# EAGLE schematic ELE3000.5 (EAGLE 6.1)
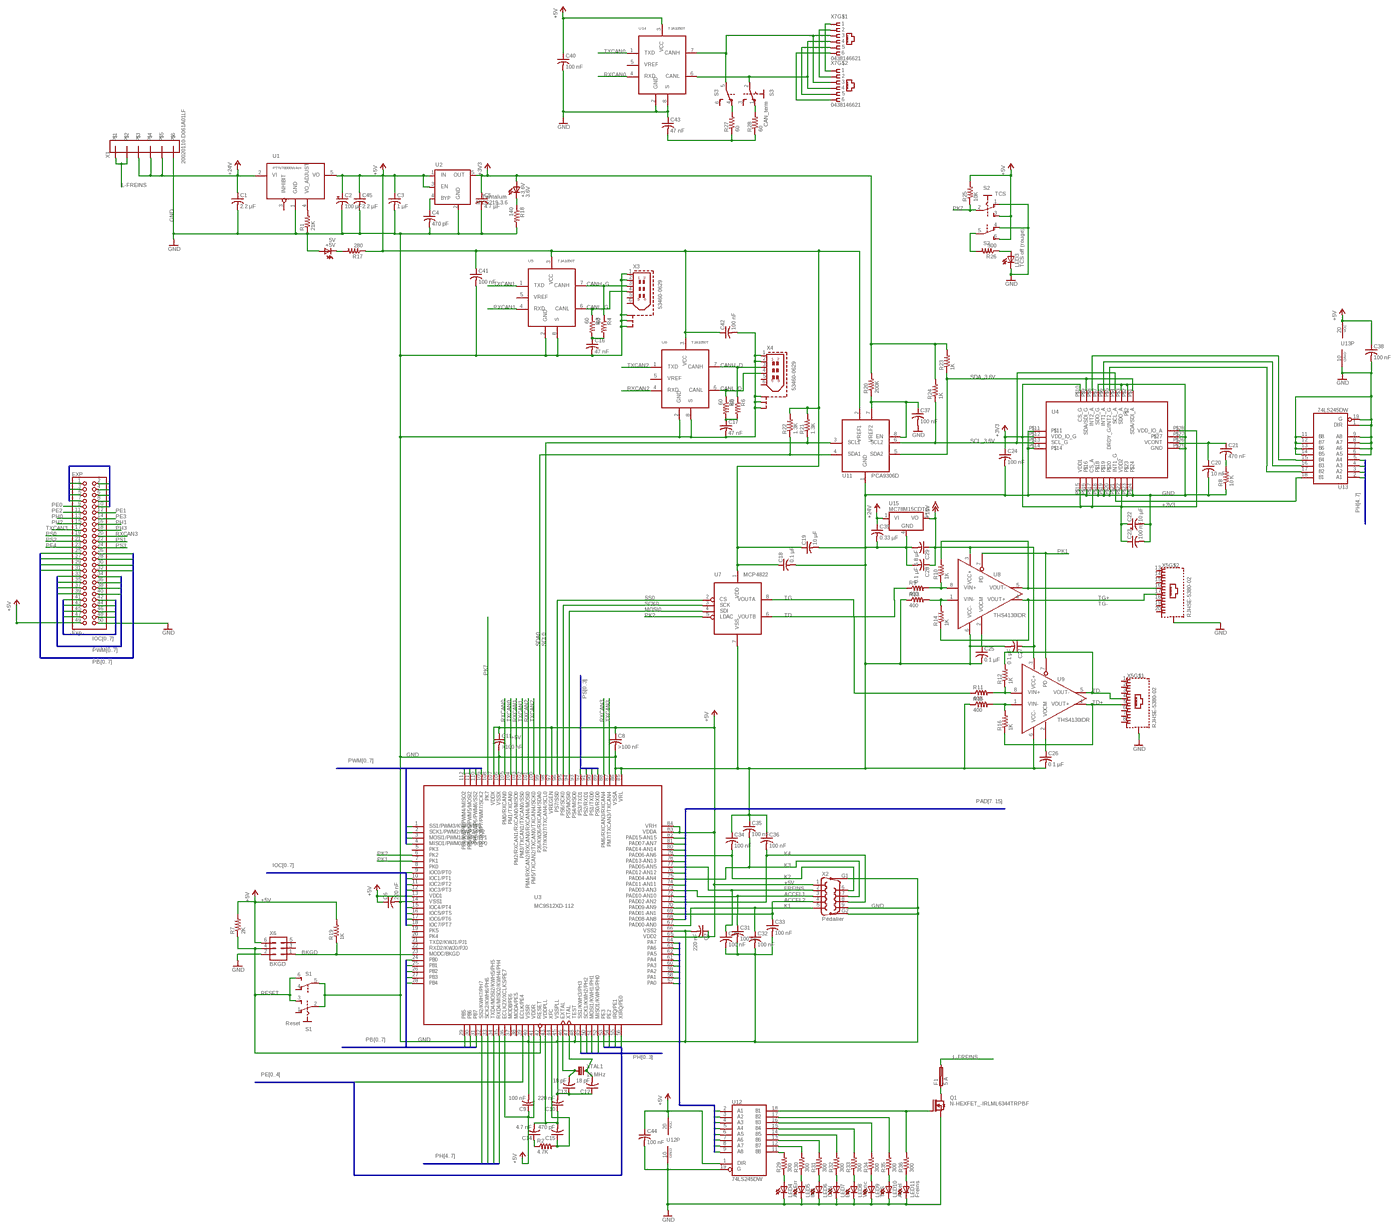
[diagram p0: schematic, sheet 1, overview]
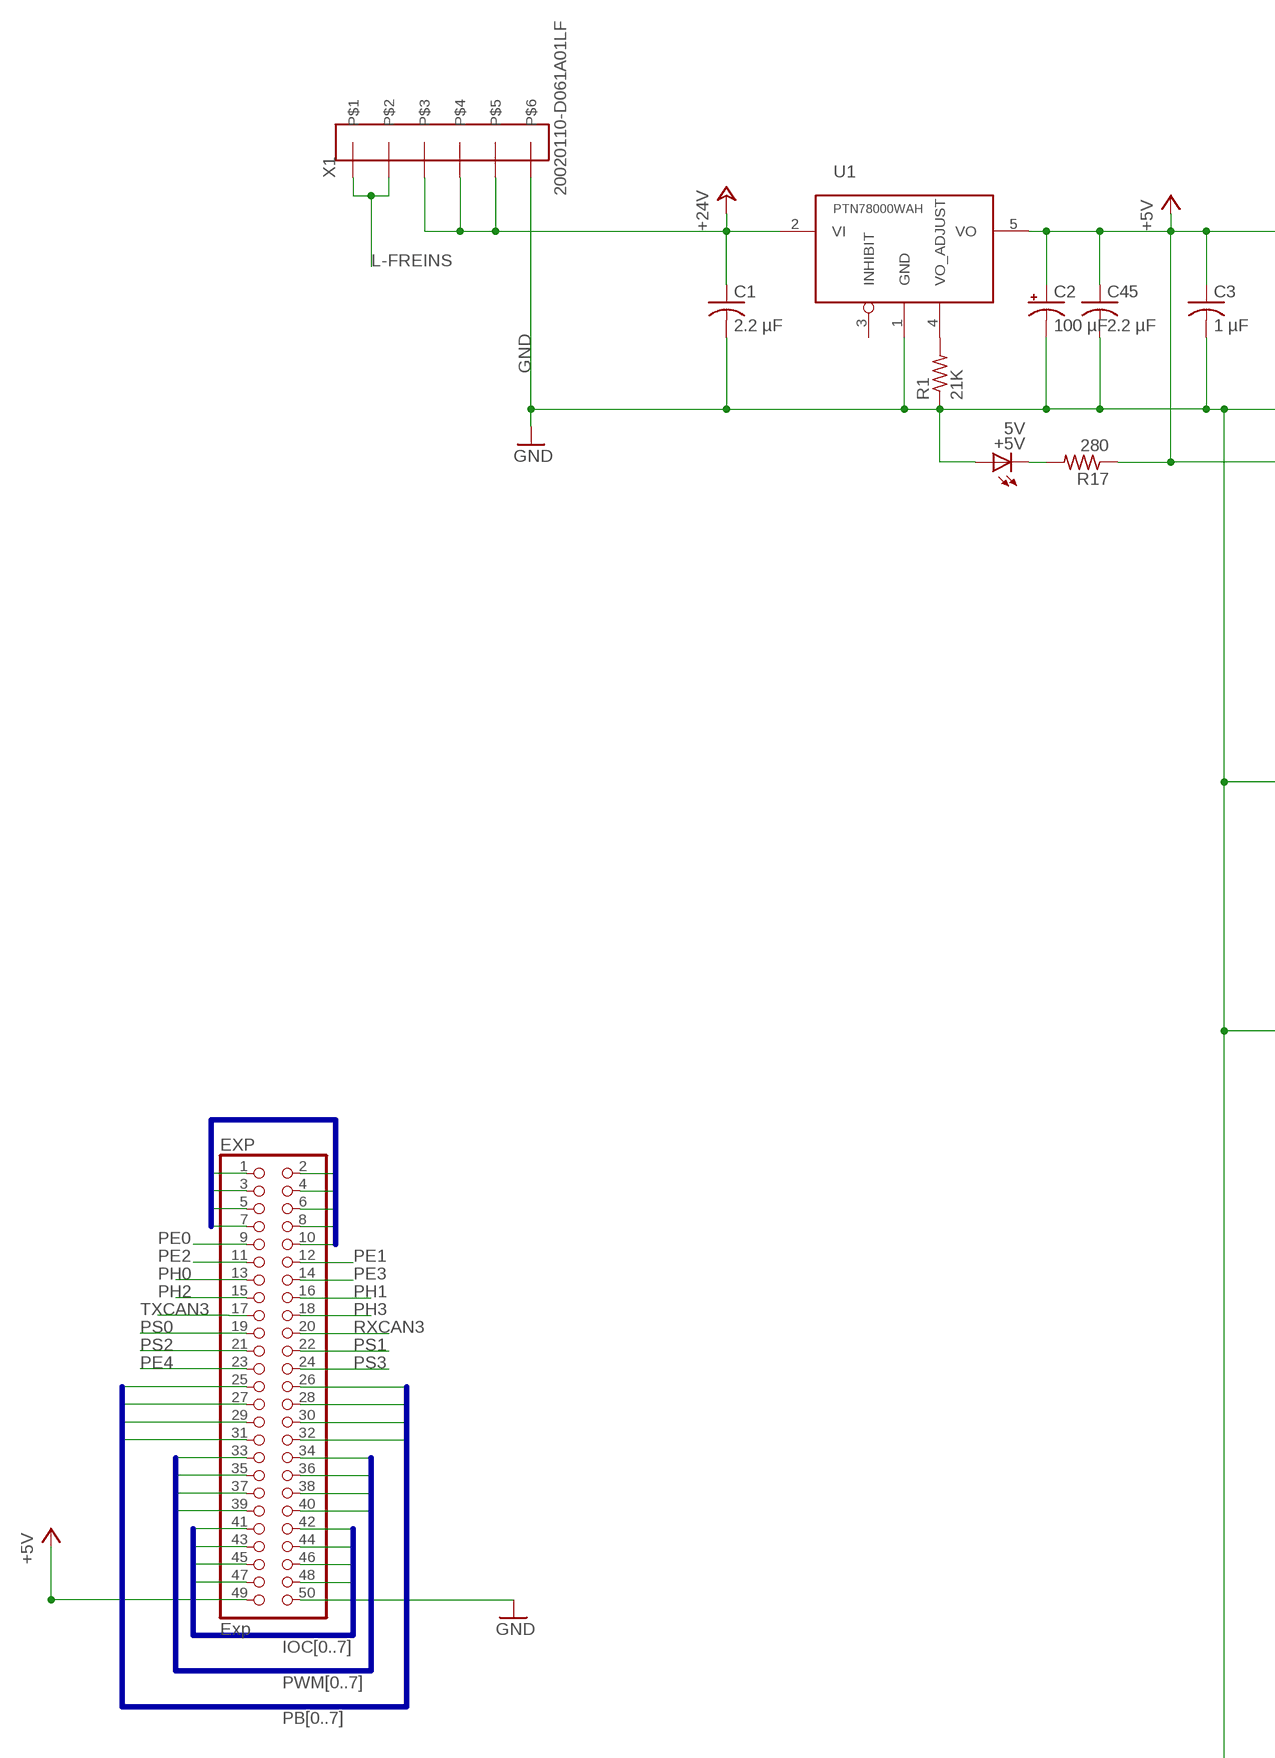
[diagram p1: schematic, sheet 1, part 1 of 4]
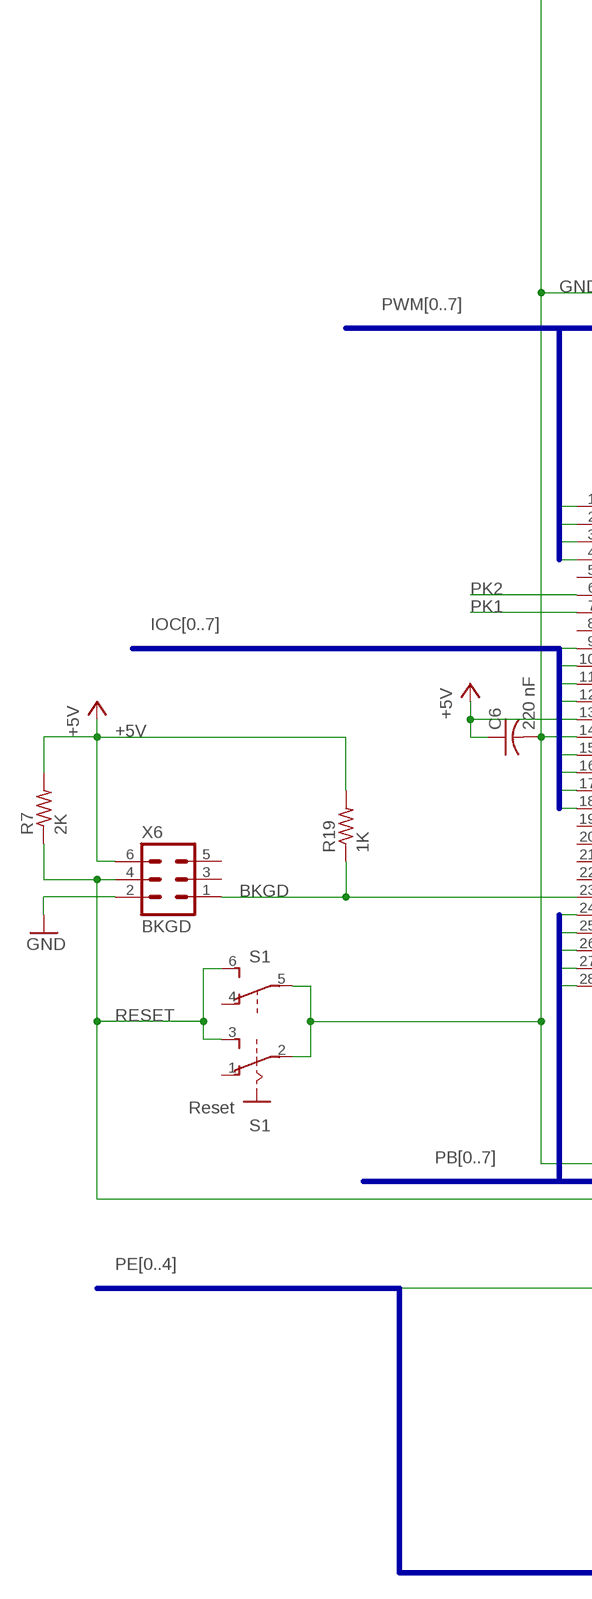
[diagram p2: schematic, sheet 1, part 2 of 4]
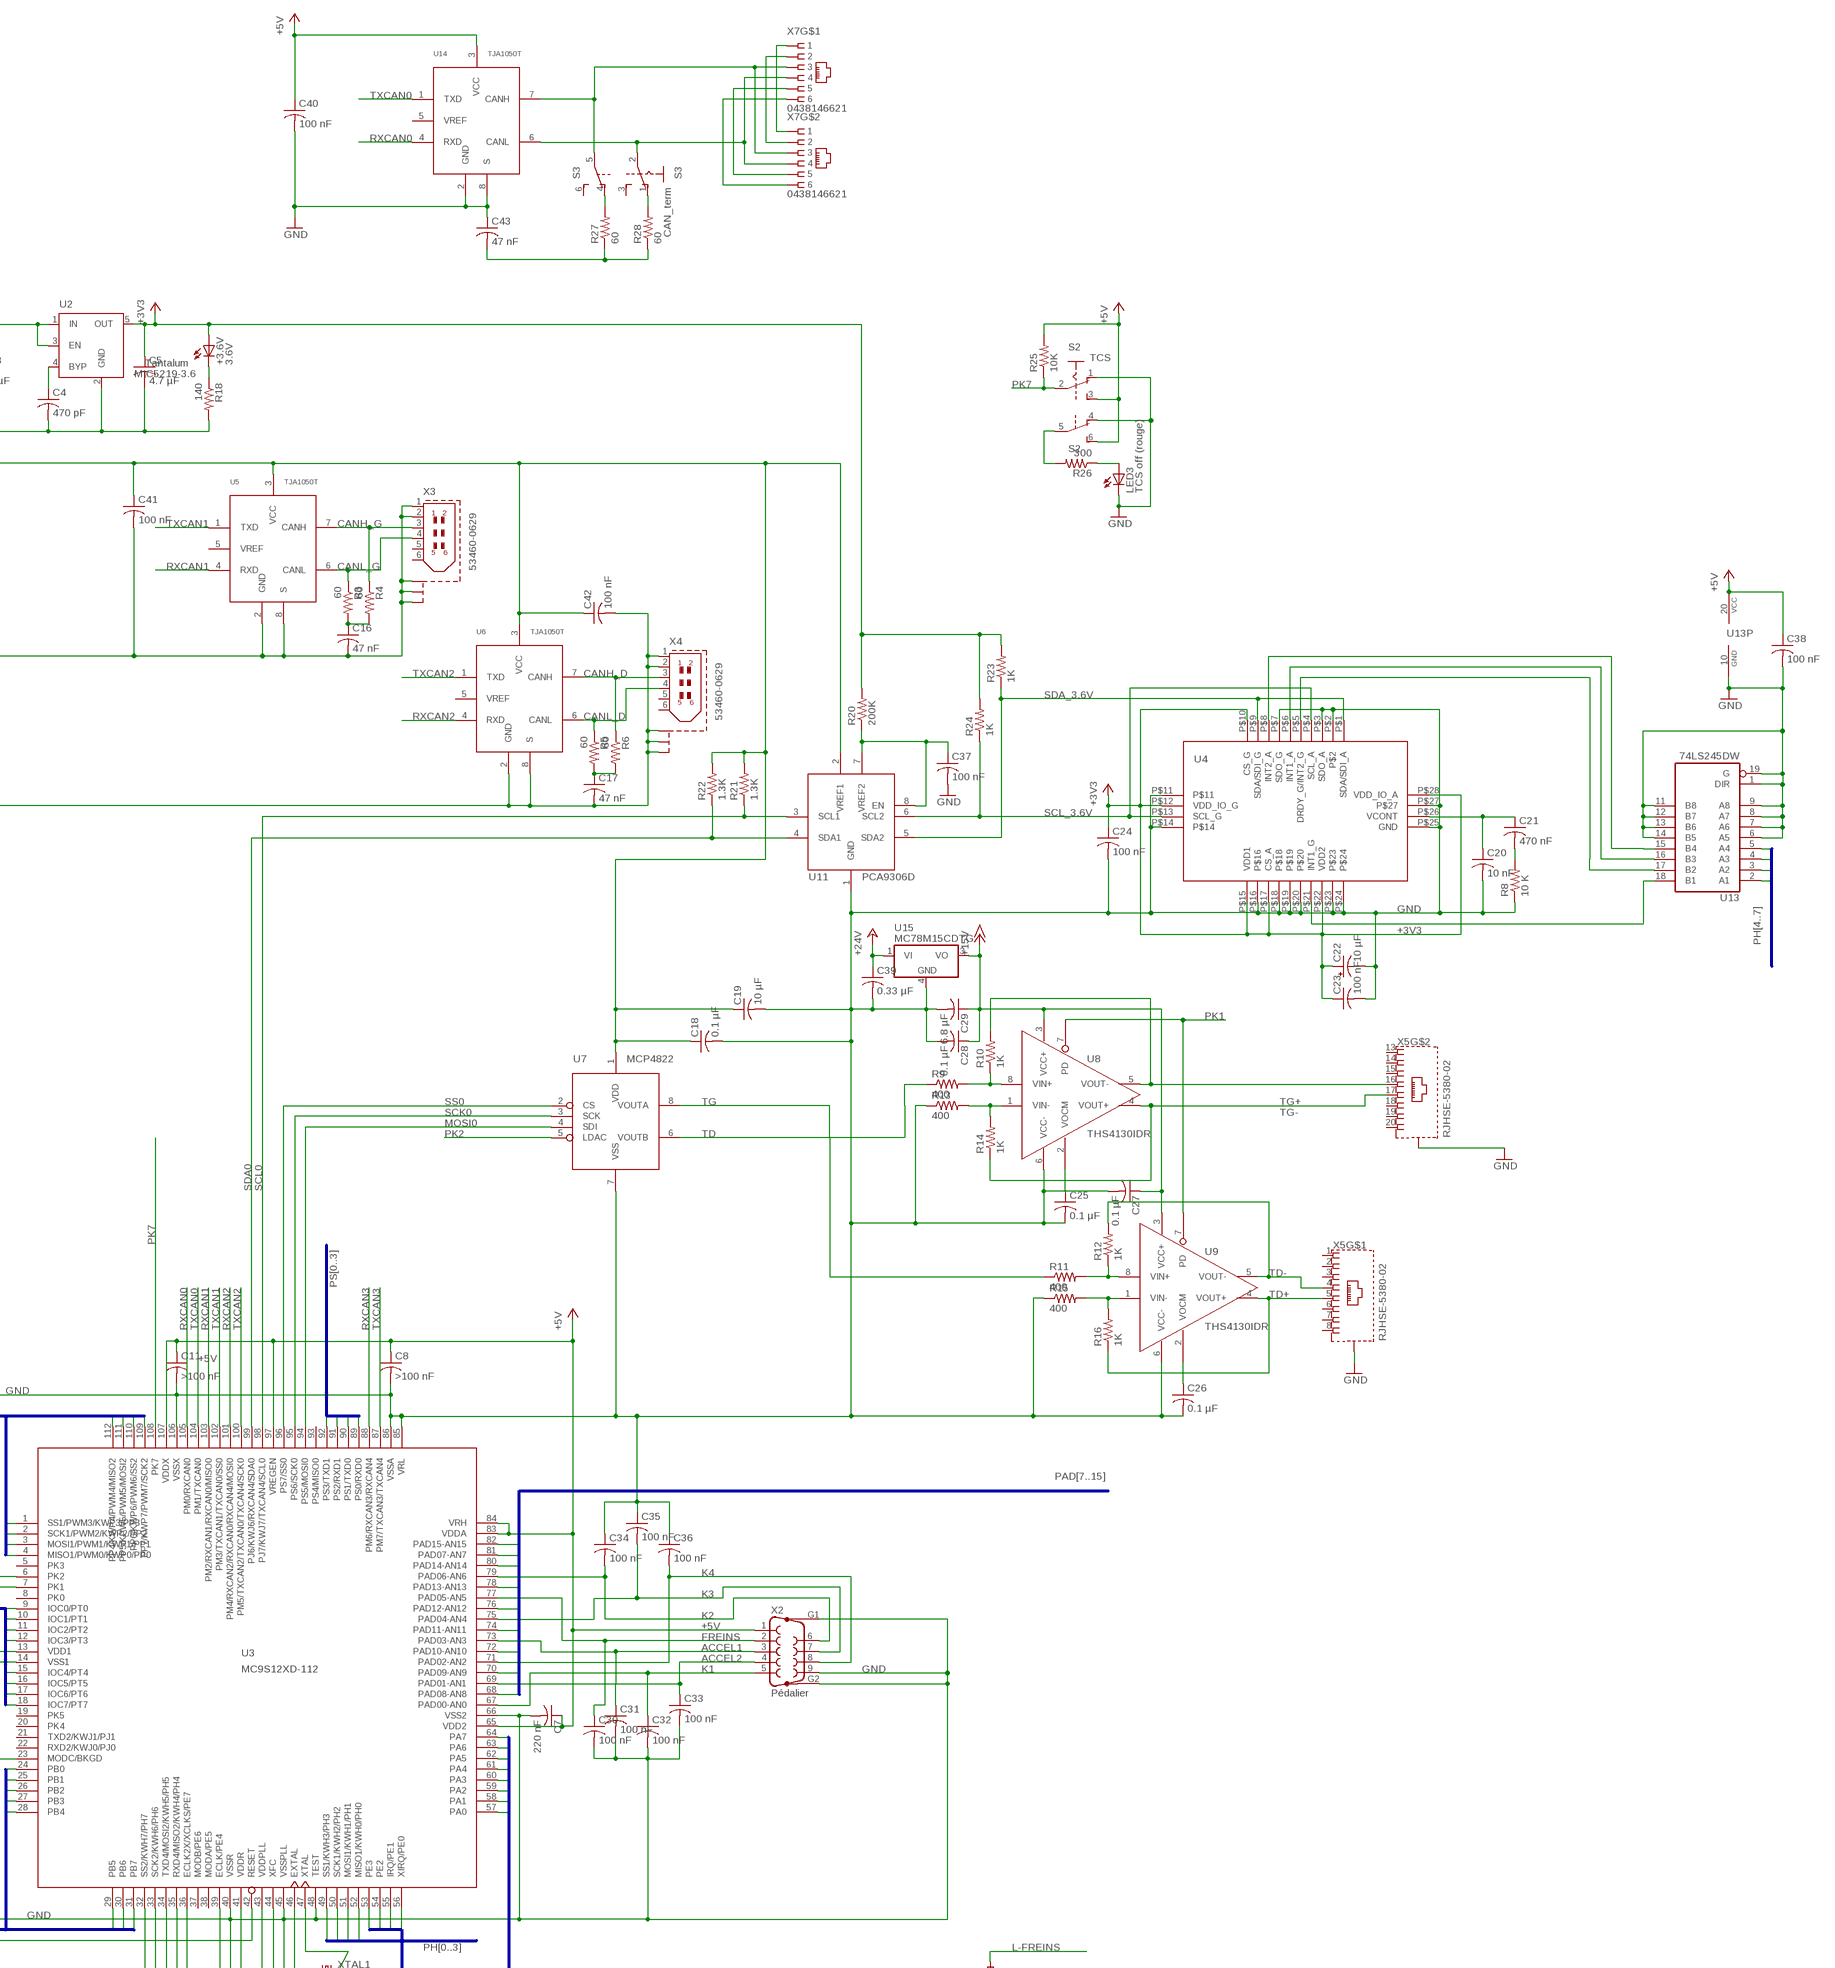
[diagram p3: schematic, sheet 1, part 3 of 4]
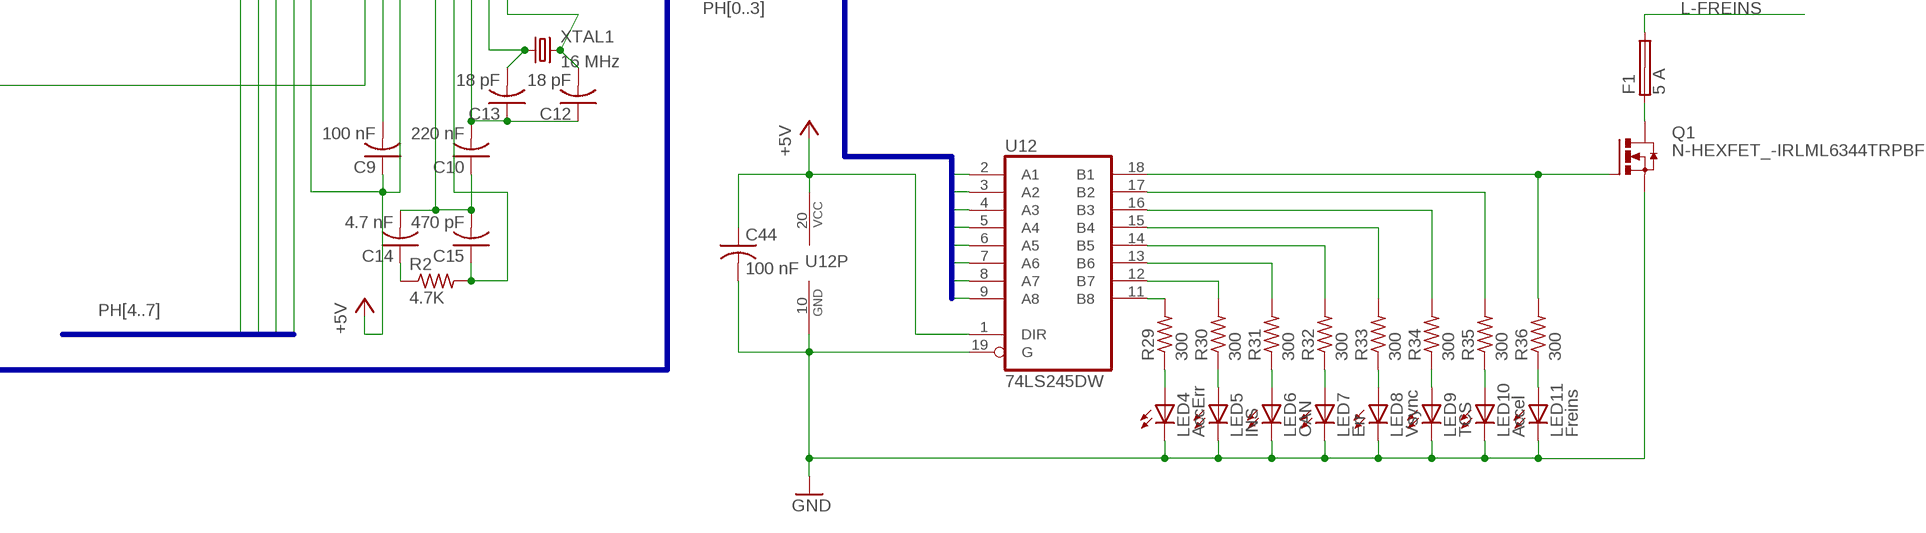
[diagram p4: schematic, sheet 1, part 4 of 4]

## Parts
+3.6V  3.6V  LEDCHIPLED_1206  [CHIPLED_1206]
+5V  5V  LEDCHIPLED_1206  [CHIPLED_1206]
C1  2.2 µF  C-USC1206  [C1206]
C2  100 µF  CPOL-USE2.5-6  [E2,5-6]
C3  1 µF  C-USC0805  [C0805]
C4  470 pF  C-USC0805  [C0805]
C5  4.7 µF  C-USC1206  [C1206]
C6  220 nF  C-USC0805  [C0805]
C7  220 nF  C-USC0805  [C0805]
C8  >100 nF  C-USC0805  [C0805]
C9  100 nF  C-USC0805  [C0805]
C10  220 nF  C-USC0805  [C0805]
C11  >100 nF  C-USC0805  [C0805]
C12  18 pF  C-USC0805  [C0805]
C13  18 pF  C-USC0805  [C0805]
C14  4.7 nF  C-USC0805  [C0805]
C15  470 pF  C-USC0805  [C0805]
C16  47 nF  C-USC0805  [C0805]
C17  47 nF  C-USC0805  [C0805]
C18  0.1 µF  C-USC0805  [C0805]
C19  10 µF  C-USC1206  [C1206]
C20  10 nF  C-USC0805  [C0805]
C21  470 nF  C-USC0805  [C0805]
C22  10 µF  CPOL-USE2-5  [E2-5]
C23  100 nF  C-USC0805  [C0805]
C24  100 nF  C-USC0805  [C0805]
C25  0.1 µF  C-USC0805  [C0805]
C26  0.1 µF  C-USC0805  [C0805]
C27  0.1 µF  C-USC0805  [C0805]
C28  0.1 µF  C-USC0805  [C0805]
C29  6.8 µF  C-USC1206  [C1206]
C30  100 nF  C-USC0805  [C0805]
C31  100 nF  C-USC0805  [C0805]
C32  100 nF  C-USC0805  [C0805]
C33  100 nF  C-USC0805  [C0805]
C34  100 nF  C-USC0805  [C0805]
C35  100 nF  C-USC0805  [C0805]
C36  100 nF  C-USC0805  [C0805]
C37  100 nF  C-USC0805  [C0805]
C38  100 nF  C-USC0805  [C0805]
C39  0.33 µF  C-USC1206  [C1206]
C40  100 nF  C-USC0805  [C0805]
C41  100 nF  C-USC0805  [C0805]
C42  100 nF  C-USC0805  [C0805]
C43  47 nF  C-USC0805  [C0805]
C44  100 nF  C-USC0805  [C0805]
C45  2.2 µF  C-USC0805  [C0805]
EXP  Exp  PINHD-2X25  [2X25]
F1  5 A  SHK20L  [SHK20L]
LED3  TCS off (rouge)  LEDCHIPLED_1206  [CHIPLED_1206]
LED4  AccErr  LEDCHIPLED_1206  [CHIPLED_1206]
LED5  INS  LEDCHIPLED_1206  [CHIPLED_1206]
LED6  CAN  LEDCHIPLED_1206  [CHIPLED_1206]
LED7  Err  LEDCHIPLED_1206  [CHIPLED_1206]
LED8  Vsync  LEDCHIPLED_1206  [CHIPLED_1206]
LED9  TCS  LEDCHIPLED_1206  [CHIPLED_1206]
LED10  Accel  LEDCHIPLED_1206  [CHIPLED_1206]
LED11  Freins  LEDCHIPLED_1206  [CHIPLED_1206]
Q1  N-HEXFET_-IRLML6344TRPBF  [MICRO3]
R1  21K  R-US_R0805  [R0805]
R2  4.7K  R-US_R0805  [R0805]
R3  60  R-US_R1206  [R1206]
R4  60  R-US_R1206  [R1206]
R5  60  R-US_R1206  [R1206]
R6  60  R-US_R1206  [R1206]
R7  2K  R-US_R0805  [R0805]
R8  10 K  R-US_R0805  [R0805]
R9  400  R-US_R0805  [R0805]
R10  1K  R-US_R0805  [R0805]
R11  400  R-US_R0805  [R0805]
R12  1K  R-US_R0805  [R0805]
R13  400  R-US_R0805  [R0805]
R14  1K  R-US_R0805  [R0805]
R15  400  R-US_R0805  [R0805]
R16  1K  R-US_R0805  [R0805]
R17  280  R-US_R0805  [R0805]
R18  140  R-US_R0805  [R0805]
R19  1K  R-US_R0805  [R0805]
R20  200K  R-US_R0805  [R0805]
R21  1.3K  R-US_R0805  [R0805]
R22  1.3K  R-US_R0805  [R0805]
R23  1K  R-US_R0805  [R0805]
R24  1K  R-US_R0805  [R0805]
R25  10K  R-US_R0805  [R0805]
R26  300  R-US_R0805  [R0805]
R27  60  R-US_R1206  [R1206]
R28  60  R-US_R1206  [R1206]
R29  300  R-US_R0805  [R0805]
R30  300  R-US_R0805  [R0805]
R31  300  R-US_R0805  [R0805]
R32  300  R-US_R0805  [R0805]
R33  300  R-US_R0805  [R0805]
R34  300  R-US_R0805  [R0805]
R35  300  R-US_R0805  [R0805]
R36  300  R-US_R0805  [R0805]
S1  Reset  JS202011CQN  [JS202011CQN]
S2  TCS  JS202011CQN  [JS202011CQN]
S3  CAN_term  JS202011CQN  [JS202011CQN]
U1  PTN78000WAH  [EUS]
U2  MIC5219-3.6  MIC5219XX  [SOT23-5]
U3  MC9S12XD-112  [SQFP-S-20X20-112]
U4  LSM330DL  [LGA-28]
U5  TJA1050T  [SO08]
U6  TJA1050T  [SO08]
U7  MCP4822  [SO08]
U8  THS4130IDR  [SO-08]
U9  THS4130IDR  [SO-08]
U11  PCA9306D  [SO08]
U12  74LS245DW  [SO20W]
U13  74LS245DW  [SO20W]
U14  TJA1050T  [SO08]
U15  MC78M15CDTG  [DPACK_3]
X1  20020110-D061A01LF  [20020110-D061A0]
X2  Pédalier  F09HP  [F09HP]
X3  53460-0629  [53460-0629]
X4  53460-0629  [53460-0629]
X5  RJHSE-5380-02  [RJHSE-5380-02]
X6  BKGD  MA03-2  [MA03-2]
X7  0438146621  [2*RJ11]
XTAL1  16 MHz  CRYSTALHC49UP  [HC49UP]

## Nets
+3V3: +3.6V.A C5.1 C22.+ C23.1 C24.1 R20.2 R23.2 R24.2 U2.5(OUT) U4.P$10(CS_G) U4.P$12(VDD_IO_G) U4.P$15(VDD1) U4.P$17(CS_A) U4.P$22(VDD2) U4.P$28(VDD_IO_A)
+5V: C2.+ C3.1 C6.1 C7.1 C8.1 C9.1 C11.1 C18.1 C19.1 C38.1 C40.1 C41.1 C42.1 C44.1 C45.1 EXP.49 R7.2 R17.1 R19.2 R21.2 R22.2 R25.2 S2.3(A:S) S2.6(B:S) U1.5(VO) U2.1(IN) U2.3(EN) U3.13(VDD1) U3.36(ECLK2X/XCLKS/PE7) U3.41(VDDR) U3.65(VDD2) U3.83(VDDA) U3.84(VRH) U3.97(VREGEN) U3.107(VDDX) U5.3(VCC) U6.3(VCC) U7.1(VDD) U11.2(VREF1) U12.1(DIR) U12.20(VCC) U13.20(VCC) U14.3(VCC) X2.1 X6.6
+15V: C27.1 C28.1 C29.1 U8.3(VCC+) U9.3(VCC+) U15.3(VO)
+24V: C1.1 C39.1 U1.2(VI) U15.1(VI) X1.P$3 X1.P$4 X1.P$5
ACCEL1: C31.1 U3.73(PAD03-AN3) X2.3
ACCEL2: C33.1 U3.69(PAD01-AN1) X2.4
BKGD: R19.1 U3.23(MODC/BKGD) X6.1
CANH_D: R6.1 U6.7(CANH) X4.3
CANH_G: R4.1 U5.7(CANH) X3.3
CANL_D: R5.1 U6.6(CANL) X4.4
CANL_G: R3.1 U5.6(CANL) X3.4
FREINS: C30.1 U3.77(PAD05-AN5) X2.2
GND: +5V.A C1.2 C2.- C3.2 C4.2 C5.2 C6.2 C7.2 C8.2 C9.2 C10.2 C11.2 C12.1 C13.1 C16.2 C17.2 C18.2 C19.2 C20.2 C22.- C23.2 C24.2 C25.2 C26.2 C27.2 C28.2 C29.2 C30.2 C31.2 C32.2 C33.2 C34.1 C35.1 C36.1 C37.2 C38.2 C39.2 C40.2 C41.2 C42.2 C43.1 C44.2 C45.2 EXP.50 LED3.C LED4.C LED5.C LED6.C LED7.C LED8.C LED9.C LED10.C LED11.C Q1.2(S) R1.1 R8.1 R13.1 R15.1 R18.2 S1.2(A:P) S1.5(B:P) S2.1(A:O) S2.4(B:O) U1.1(GND) U2.2(GND) U3.14(VSS1) U3.40(VSSR) U3.45(VSSPLL) U3.48(TEST) U3.66(VSS2) U3.85(VRL) U3.86(VSSA) U3.106(VSSX) U4.P$2 U4.P$3(SDO_A) U4.P$7(SDO_G) U4.P$11 U4.P$14 U4.P$16 U4.P$18 U4.P$19 U4.P$20 U4.P$23 U4.P$24 U4.P$25(GND) U4.P$27 U5.2(GND) U5.8(S) U6.2(GND) U6.8(S) U7.7(VSS) U8.6(VCC-) U9.6(VCC-) U11.1(GND) U12.10(GND) U12.19(G) U13.1(DIR) U13.6(A5) U13.7(A6) U13.8(A7) U13.9(A8) U13.10(GND) U13.11(B8) U13.12(B7) U13.13(B6) U13.14(B5) U13.19(G) U14.2(GND) U14.8(S) U15.4(GND) X1.P$6 X2.9 X2.G1 X2.G2 X3.1 X3.2 X3.S1 X3.S2 X3.S3 X4.1 X4.2 X4.S1 X4.S2 X4.S3 X5.P$1(S) X5.P$2(S) X6.2
IOC0: EXP.47 U3.9(IOC0/PT0)
IOC1: EXP.48 U3.10(IOC1/PT1)
IOC2: EXP.45 U3.11(IOC2/PT2)
IOC3: EXP.46 U3.12(IOC3/PT3)
IOC4: EXP.43 U3.15(IOC4/PT4)
IOC5: EXP.44 U3.16(IOC5/PT5)
IOC6: EXP.41 U3.17(IOC6/PT6)
IOC7: EXP.42 U3.18(IOC7/PT7)
K1: C32.1 U3.67(PAD00-AN0) X2.5
K2: C34.2 U3.79(PAD06-AN6) X2.6
K3: C35.2 U3.75(PAD04-AN4) X2.7
K4: C36.2 U3.71(PAD02-AN2) X2.8
L-FREINS: F1.2A X1.P$1 X1.P$2
MOSI0: U3.94(PS5/MOSI0) U7.4(SDI)
N$1: R1.2 U1.4(VO_ADJUST)
N$2: C4.1 U2.4(BYP)
N$3: Q1.1(G) R36.2 U12.18(B1)
N$4: U4.P$21(INT1_G) U13.18(B1)
N$5: C12.2 U3.47(XTAL) XTAL1.2
N$6: C10.1 C14.2 C15.2 U3.43(VDDPLL)
N$7: C14.1 R2.1
N$8: C15.1 R2.2 U3.44(XFC)
N$9: R26.2 S2.5(B:P)
N$10: U4.P$5(DRDY_G/INT2_G) U13.17(B2)
N$11: C13.2 U3.46(EXTAL) XTAL1.1
N$12: U4.P$6(INT1_A) U13.16(B3)
N$13: U4.P$8(INT2_A) U13.15(B4)
N$14: C17.1 R5.2 R6.2
N$15: LED3.A R26.1
N$16: X7.1 X7.7
N$17: F1.1A Q1.3(D)
N$18: C16.1 R3.2 R4.2
N$19: X7.2 X7.8
N$20: S3.5(B:P) U14.7(CANH) X7.3 X7.9
N$21: R27.2 S3.4(B:O)
N$22: C20.1 C21.1 U4.P$26(VCONT)
N$23: C21.2 R8.2
N$24: S3.2(A:P) U14.6(CANL) X7.4 X7.10
N$25: X7.5 X7.11
N$26: X7.6 X7.12
N$27: C43.2 R27.1 R28.1
N$28: R9.2 R10.1 U8.8(VIN+)
N$29: R13.2 R14.2 U8.1(VIN-)
N$30: +5V.C R17.2
N$31: R28.2 S3.1(A:O)
N$32: C26.1 U9.2(VOCM)
N$33: C25.1 U8.2(VOCM)
N$34: +3.6V.C R18.1
N$35: R15.2 R16.2 U9.1(VIN-)
N$36: R11.2 R12.1 U9.8(VIN+)
N$39: R29.2 U12.11(B8)
N$40: R30.2 U12.12(B7)
N$41: R31.2 U12.13(B6)
N$42: R32.2 U12.14(B5)
N$43: R33.2 U12.15(B4)
N$44: R34.2 U12.16(B3)
N$45: R35.2 U12.17(B2)
N$47: LED11.A R36.1
N$48: LED10.A R35.1
N$49: LED9.A R34.1
N$50: LED8.A R33.1
N$51: LED7.A R32.1
N$52: LED6.A R31.1
N$53: LED5.A R30.1
N$54: LED4.A R29.1
PA0: U3.57(PA0) U12.2(A1)
PA1: U3.58(PA1) U12.3(A2)
PA2: U3.59(PA2) U12.4(A3)
PA3: U3.60(PA3) U12.5(A4)
PA4: U3.61(PA4) U12.6(A5)
PA5: U3.62(PA5) U12.7(A6)
PA6: U3.63(PA6) U12.8(A7)
PA7: U3.64(PA7) U12.9(A8)
PAD7: EXP.1 U3.81(PAD07-AN7)
PAD8: EXP.10 U3.68(PAD08-AN8)
PAD9: EXP.7 U3.70(PAD09-AN9)
PAD10: EXP.8 U3.72(PAD10-AN10)
PAD11: EXP.5 U3.74(PAD11-AN11)
PAD12: EXP.6 U3.76(PAD12-AN12)
PAD13: EXP.3 U3.78(PAD13-AN13)
PAD14: EXP.4 U3.80(PAD14-AN14)
PAD15: EXP.2 U3.82(PAD15-AN15)
PB0: EXP.31 U3.24(PB0)
PB1: EXP.32 U3.25(PB1)
PB2: EXP.29 U3.26(PB2)
PB3: EXP.30 U3.27(PB3)
PB4: EXP.27 U3.28(PB4)
PB5: EXP.28 U3.29(PB5)
PB6: EXP.25 U3.30(PB6)
PB7: EXP.26 U3.31(PB7)
PE0: EXP.9 U3.56(XIRQ/PE0)
PE1: EXP.12 U3.55(IRQ/PE1)
PE2: EXP.11 U3.54(PE2)
PE3: EXP.14 U3.53(PE3)
PE4: EXP.23 U3.39(ECLK/PE4)
PH0: EXP.13 U3.52(MISO1/KWH0/PH0)
PH1: EXP.16 U3.51(MOSI1/KWH1/PH1)
PH2: EXP.15 U3.50(SCK1/KWH2/PH2)
PH3: EXP.18 U3.49(SS1/KWH3/PH3)
PH4: U3.35(RXD4/MISO2/KWH4/PH4) U13.2(A1)
PH5: U3.34(TXD4/MOSI2/KWH5/PH5) U13.3(A2)
PH6: U3.33(SCK2/KWH6/PH6) U13.4(A3)
PH7: U3.32(SS2/KWH7/PH7) U13.5(A4)
PK1: U3.7(PK1) U8.7(PD) U9.7(PD)
PK2: U3.6(PK2) U7.5(LDAC)
PK7: R25.1 S2.2(A:P) U3.108(PK7)
PS0: EXP.19 U3.89(PS0/RXD0)
PS1: EXP.22 U3.90(PS1/TXD0)
PS2: EXP.21 U3.91(PS2/RXD1)
PS3: EXP.24 U3.92(PS3/TXD1)
PWM0: EXP.33 U3.4(MISO1/PWM0/KWP0/PP0)
PWM1: EXP.34 U3.3(MOSI1/PWM1/KWP1/PP1)
PWM2: EXP.35 U3.2(SCK1/PWM2/KWP2/PP2)
PWM3: EXP.36 U3.1(SS1/PWM3/KWP3/PP3)
PWM4: EXP.37 U3.112(PP4/KWP4/PWM4/MISO2)
PWM5: EXP.38 U3.111(PP5/KPW5/PWM5/MOSI2)
PWM6: EXP.39 U3.110(PP6/KWP6/PWM6/SS2)
PWM7: EXP.40 U3.109(PP7/KWP7/PWM7/SCK2)
RESET: R7.1 S1.3(A:S) S1.6(B:S) U3.42(RESET) X6.4
RXCAN0: U3.105(PM0/RXCAN0) U14.4(RXD)
RXCAN1: U3.103(PM2/RXCAN1/RXCAN0/MISO0) U5.4(RXD)
RXCAN2: U3.101(PM4/RXCAN2/RXCAN0/RXCAN4/MOSI0) U6.4(RXD)
RXCAN3: EXP.20 U3.88(PM6/RXCAN3/RXCAN4)
SCK0: U3.95(PS6/SCK0) U7.3(SCK)
SCL0: R21.1 U3.98(PJ7/KWJ7/TXCAN4/SCL0) U11.3(SCL1)
SCL_3.6V: R24.1 U4.P$4(SCL_A) U4.P$13(SCL_G) U11.6(SCL2)
SDA0: R22.1 U3.99(PJ6/KWJ6/RXCAN4/SDA0) U11.4(SDA1)
SDA_3.6V: R23.1 U4.P$1(SDA/SDI_A) U4.P$9(SDA/SDI_G) U11.5(SDA2)
SS0: U3.96(PS7/SS0) U7.2(CS)
TD: R11.1 U7.8(VOUTA)
TD+: R16.1 U9.4(VOUT+) X5.5
TD-: R12.2 U9.5(VOUT-) X5.4
TG: R9.1 U7.6(VOUTB)
TG+: R14.1 U8.4(VOUT+) X5.17
TG-: R10.2 U8.5(VOUT-) X5.16
TXCAN0: U3.104(PM1/TXCAN0) U14.1(TXD)
TXCAN1: U3.102(PM3/TXCAN1/TXCAN0/SS0) U5.1(TXD)
TXCAN2: U3.100(PM5/TXCAN2/TXCAN0/TXCAN4/SCK0) U6.1(TXD)
TXCAN3: EXP.17 U3.87(PM7/TXCAN3/TXCAN4)
VREF2: C37.1 R20.1 U11.7(VREF2) U11.8(EN)
Unconnected: F1.1B F1.2B S1.1(A:O) S1.4(B:O) S3.3(A:S) S3.6(B:S) U1.3(INHIBIT) U3.5(PK3) U3.8(PK0) U3.19(PK5) U3.20(PK4) U3.21(TXD2/KWJ1/PJ1) U3.22(RXD2/KWJ0/PJ0) U3.37(MODB/PE6) U3.38(MODA/PE5) U3.93(PS4/MISO0) U5.5(VREF) U6.5(VREF) U14.5(VREF) X3.5 X3.6 X4.5 X4.6 X5.1 X5.2 X5.3 X5.6 X5.7 X5.8 X5.13 X5.14 X5.15 X5.18 X5.19 X5.20 X6.3 X6.5

## Buses
PE[0..4]
PH[4..7]
PA[0..7]
PB[0..7]
PWM[0..7]
PS[0..3]
IOC[0..7]
PH[0..3]
PAD[7..15]

## Library data of the parts
+3.6V +5V LED3-LED11 = led:LED: LED OSRAM: - CHIPLED LG R971, LG N971, LY N971, LG Q971, LY Q971, LO R971, LY R971 LH N974, LH R974 LS Q976, LO Q976, LY Q976 LO Q996 - Hyper CHIPLED LW Q18S LB Q993, LB Q99A, LB R99A - SideLED LS A670, LO A670, LY A670, LG A670, LP A670 LB A673, LV A673, LT A673, LW A673 LH A674 LY A675 LS A676, LA A676, LO A676, LY A676, LW A676 LS A679, LY A679, LG A679 - Hyper Micro SIDELED® LS Y876, LA Y876, LO Y876, LY Y876 LT Y87S - SmartLED LW L88C, LW L88S LB L89C, LB L89S, LG L890 LS L89K, LO L89K, LY L89K LS L896, LA L896, LO L896, LY L896 - TOPLED LS T670, LO T670, LY T670, LG T670, LP T670 LSG T670, LSP T670, LSY T670, LOP T670, LYG T670 LG T671, LOG T671, LSG T671 LB T673, LV T673, LT T673, LW T673 LH T674 LS T676, LA T676, LO T676, LY T676, LB T676, LH T676, LSB T676, LW T676 LB T67C, LV T67C, LT T67C, LS T67K, LO T67K, LY T67K, LW E67C LS E67B, LA E67B, LO E67B, LY E67B, LB E67C, LV E67C, LT E67C LW T67C LS T679, LY T679, LG T679 LS T770, LO T770, LY T770, LG T770, LP T770 LB T773, LV T773, LT T773, LW T773 LH T774 LS E675, LA E675, LY E675, LS T675 LS T776, LA T776, LO T776, LY T776, LB T776 LHGB T686 LT T68C, LB T68C - Hyper Mini TOPLED® LB M676 - Mini TOPLED Santana® LG M470 LS M47K, LO M47K, LY M47K Source: http://www.osram.convergy.de LUXEON: - LUMILED® LXK2-PW12-R00, LXK2-PW12-S00, LXK2-PW14-U00, LXK2-PW14-V00 LXK2-PM12-R00, LXK2-PM12-S00, LXK2-PM14-U00 LXK2-PE12-Q00, LXK2-PE12-R00, LXK2-PE12-S00, LXK2-PE14-T00, LXK2-PE14-U00 LXK2-PB12-K00, LXK2-PB12-L00, LXK2-PB12-M00, LXK2-PB14-N00, LXK2-PB14-P00, LXK2-PB14-Q00 LXK2-PR12-L00, LXK2-PR12-M00, LXK2-PR14-Q00, LXK2-PR14-R00 LXK2-PD12-Q00, LXK2-PD12-R00, LXK2-PD12-S00 LXK2-PH12-R00, LXK2-PH12-S00 LXK2-PL12-P00, LXK2-PL12-Q00, LXK2-PL12-R00 Source: www.luxeon.com KINGBRIGHT: KA-3528ASYC Source: www.kingbright.com
C1 = rcl:C-US: CAPACITOR, American symbol; DIGIKEY: 587-2911-1-ND; TEMP_COEFF: X7R; TOLERANCE: ±10%; VOLTAGE: 50 V
C2 = rcl:CPOL-US: POLARIZED CAPACITOR, American symbol; DIGIKEY: 399-6103-ND; VOLTAGE: 25V
C3 = rcl:C-US: CAPACITOR, American symbol; DIGIKEY: 490-1692-1-ND
C4 = rcl:C-US: CAPACITOR, American symbol; DIGIKEY: 490-1611-1-ND
C5 = rcl:C-US: CAPACITOR, American symbol; DIGIKEY: 493-2333-1-ND; TYPE: Tantalum
C6-C21 C23-C44 = rcl:C-US: CAPACITOR, American symbol
C22 = rcl:CPOL-US: POLARIZED CAPACITOR, American symbol
C45 = rcl:C-US: CAPACITOR, American symbol; DIGIKEY: 399-6103-ND; VOLTAGE: 25V
EXP = pinhead:PINHD-2X25: PIN HEADER
F1 = fuse:SHK20L: FUSE HOLDER 5 x 20 mm, SH contact, SHH1 Schukat, E1073 Buerklin; OC_FARNELL: unknown; OC_NEWARK: unknown
Q1 = ELE3000:N-HEXFET_?-*: HEXFET® Power MOSFET
R1 = rcl:R-US_: RESISTOR, American symbol; DIGIKEY: 311-21.0KCRCT-ND; POWER: 0.125 W; TEMP_COEFF: ±100ppm/°C; TOLERANCE: ±1%
R2-R36 = rcl:R-US_: RESISTOR, American symbol
S1-S3 = ELE3000:JS202011CQN: SLIDING SWITCH Siemens, distributor Buerklin, 11G766
U1 = ELE3000:PTN78000W: DC-DC switching regulator
U2 = v-reg-micrel:MIC5219XX: VOLTAGE REGULATOR; OC_FARNELL: unknown; OC_NEWARK: unknown
U3 = ELE3000:MC9S12XD-112: MC9S12XF512 Source: www.freescale.com .. MC9S12XF512V1RM.pdf; OC_FARNELL: unknown; OC_NEWARK: unknown
U4 = ELE3000:LSM330DL: 3D accelerometer sensor and 3D gyroscope sensor
U5 U6 U14 = ELE3000:TJA1050: High speed CAN transceiver
U7 = ELE3000:MCP4822
U8 U9 = ELE3000:THS4130
U11 = ELE3000:PCA9306
U12 U13 = 74xx-us:74*245: Octal BUS TRANSCEIVER, 3-state
U15 = linear:MC78M: 500 mA Positive Voltage Regulators Source: Data sheet <http://www.onsemi.com/pub_link/Collateral/MC78M00-D.PDF>
X1 = ELE3000:20020110-D061A01LF: Terminal block Header 6 positions 3.81 mm right angle
X2 = con-subd:F09HP: SUB-D; OC_FARNELL: unknown; OC_NEWARK: unknown
X3 X4 = con-molex:53460-0629: IEEE 1394 Firewire Connector 6P 2.0 I/O SOCKET RIGHT-ANGLE UPRIGHT WITH KINK Source: 53460-0629.pdf also DWG.NO. SD-53460-0621; MF: MOLEX; MPN: 53460-0629; OC_FARNELL: unknown; OC_NEWARK: 84K7541
X5 = ELE3000:RJHSE-5380-02
X6 = con-lstb:MA03-2: PIN HEADER; OC_FARNELL: unknown; OC_NEWARK: unknown
X7 = ELE3000:0438146621: 2x RJ11 Molex 438146621
XTAL1 = crystal:CRYSTAL: CRYSTAL; OC_FARNELL: unknown; OC_NEWARK: unknown